# Altium project GeecPE.PrjPcb
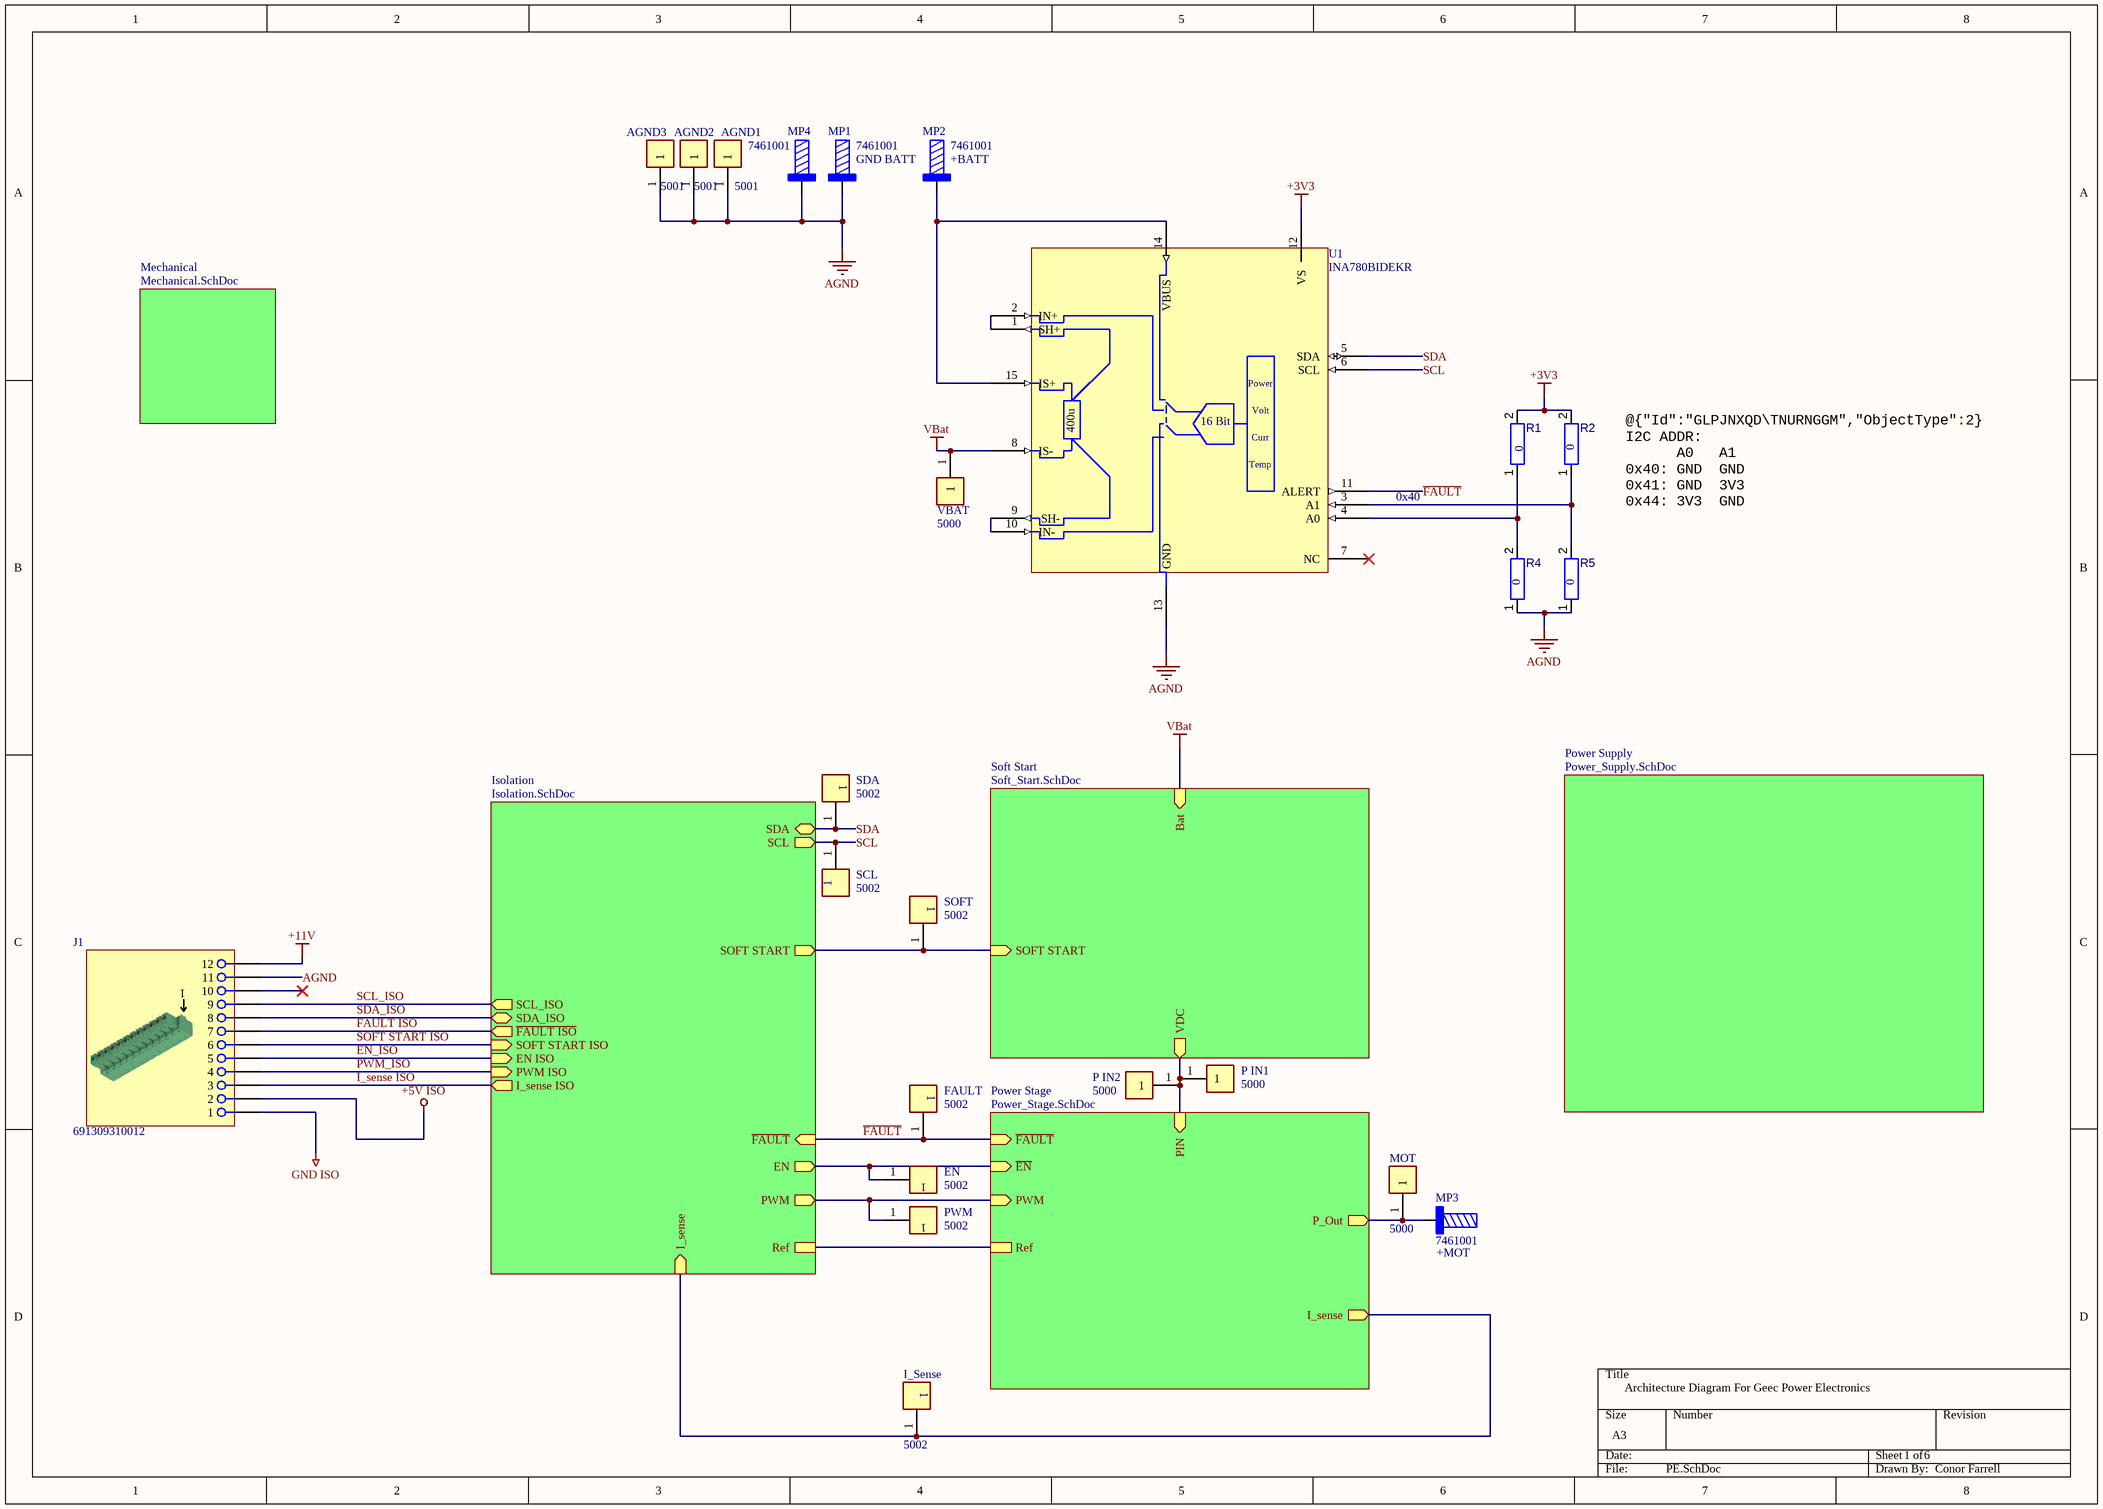
[diagram p0: PE.SchDoc]
6 sheets, 166 parts. Net scope: hierarchical (ports join the sheet entries above them; power ports are global).
Board file: PowerElec.PcbDoc
Sheets:
  PE.SchDoc
    Soft Start = Soft_Start.SchDoc
    Isolation = Isolation.SchDoc
    Power Supply = Power_Supply.SchDoc
    Power Stage = Power_Stage.SchDoc
    Mechanical = Mechanical.SchDoc

## Sheet PE.SchDoc: Architecture Diagram For Geec Power Electronics
size A3; Author: Conor Farrell; SheetNumber: 1; SheetTotal: 6

### Parts
AGND1  5001  [FP-5001-MFG]
AGND2  5001  [FP-5001-MFG]
AGND3  5001  [FP-5001-MFG]
EN  5002  [FP-5002-MFG]
FAULT  5002  [FP-5002-MFG]
I_Sense  5002  [FP-5002-MFG]
J1  691309310012  [691309310012]
MOT  5000  [FP-5000-MFG]
MP1  7461001  [7461001_chemical surface]
MP2  7461001  [7461001_chemical surface]
MP3  7461001  [7461001_chemical surface]
MP4  7461001  [7461001_chemical surface]
P_IN1  5000  [FP-5000-MFG]
P_IN2  5000  [FP-5000-MFG]
PWM  5002  [FP-5002-MFG]
R1  value 0  [RESC3216X60X45NL15T20]  (hidden comment: 1206W4F0000T5E)
R2  value 0  [RESC3216X60X45NL15T20]  (hidden comment: 1206W4F0000T5E)
R4  value 0  [RESC3216X60X45NL15T20]  (hidden comment: 1206W4F0000T5E)
R5  value 0  [RESC3216X60X45NL15T20]  (hidden comment: 1206W4F0000T5E)
SCL  5002  [FP-5002-MFG]
SDA  5002  [FP-5002-MFG]
SOFT  5002  [FP-5002-MFG]
U1  INA780BIDEKR  [VQFN15_DEK_TEX]
VBAT  5000  [FP-5000-MFG]

### Sub-sheets
Isolation = Isolation.SchDoc: Ref, I_sense (in), PWM (out), ~{FAULT ISO} (out), ~{FAULT} (in), SOFT START ISO (in), SOFT START (out), SDA_ISO (bidir), SDA (bidir), SCL_ISO (out), SCL (out), PWM ISO (in), I_sense ISO (out), EN ISO (in), EN (out)
Mechanical = Mechanical.SchDoc: no entries
Power Stage = Power_Stage.SchDoc: PIN (in), Ref, I_sense (out), P_Out (out), ~{EN} (in), ~{FAULT} (in), PWM (in)
Power Supply = Power_Supply.SchDoc: no entries
Soft Start = Soft_Start.SchDoc: Bat (in), VDC (out), SOFT START (in)

### Nets
+3V3: R1.2 R2.2 U1.12(VS)
+5V ISO: J1.2
+11V: J1.12
AGND: AGND1.1 AGND2.1 AGND3.1 J1.11 MP1.1 MP4.1 R4.1 R5.1 U1.13(GND)
GND ISO: J1.1
P_IN: P_IN1.1 P_IN2.1 ; sheet Soft Start/VDC, sheet Power Stage/PIN
VBat: U1.8(IS-) VBAT.1 ; sheet Soft Start/Bat
~{FAULT}: FAULT.1 U1.11(ALERT) ; sheet Isolation/~{FAULT}, sheet Power Stage/~{FAULT}
~{FAULT ISO}: J1.7 ; sheet Isolation/~{FAULT ISO}
EN_ISO: J1.5 ; sheet Isolation/EN ISO
I_sense ISO: J1.3 ; sheet Isolation/I_sense ISO
PWM: PWM.1 ; sheet Isolation/PWM, sheet Power Stage/PWM
PWM_ISO: J1.4 ; sheet Isolation/PWM ISO
SCL: SCL.1 U1.6(SCL) ; sheet Isolation/SCL
SCL_ISO: J1.9 ; sheet Isolation/SCL_ISO
SDA: SDA.1 U1.5(SDA) ; sheet Isolation/SDA
SDA_ISO: J1.8 ; sheet Isolation/SDA_ISO
Soft START: SOFT.1 ; sheet Soft Start/SOFT START, sheet Isolation/SOFT START
SOFT START ISO: J1.6 ; sheet Isolation/SOFT START ISO
NetEN_1: EN.1 ; sheet Isolation/EN, sheet Power Stage/~{EN}
NetI_Sense_1: I_Sense.1 ; sheet Isolation/I_sense, sheet Power Stage/I_sense
NetMOT_1: MOT.1 MP3.1 ; sheet Power Stage/P_Out
NetMP2_1: MP2.1 U1.14(VBUS) U1.15(IS+)
NetP5_2: sheet Isolation/Ref, sheet Power Stage/Ref
NetR1_1: R1.1 R4.2 U1.4(A0)
NetR2_1: R2.1 R5.2 U1.3(A1)
NetU1_1: U1.1(SH+) U1.2(IN+)
NetU1_9: U1.9(SH-) U1.10(IN-)

Not connected (* = marked no-connect by the designer): J1 10*; U1 7(NC)*

### Notes on the sheet
- (near MP1) GND BATT
- (near MP2) +BATT
- 0x40
- @{"Id":"GLPJNXQD\TNURNGGM","ObjectType":2} I2C ADDR:
  A0   A1
  0x40: GND  GND
  0x41: GND  3V3
  0x44: 3V3  GND
  0x45: 3V3  3V3
- (near MP3) +MOT
- (in symbol CMP-004-000000-8) Power; Volt; 400u; 16 Bit; Curr; Temp

### Library data of the parts
AGND1-AGND3 = CMP-00030-00001-2: Test Point, Mini, Thm, Pc, .300 L, .100 Od, Heat Resistant Nylon 46, Black; Hole Diameter: 1.6mm; Color: Black; Pins: 1; Mounting Technology: PCB, Through Hole
EN FAULT I_Sense PWM SCL SDA SOFT = CMP-00030-00002-2: Test Point, Mini, Thm, Pc, .300 L, .100 Od, Heat Resistant Nylon 46, White; Hole Diameter: 1.6mm; Color: White; Mounting Technology: PCB, Through Hole
J1 = CMP-002-00074-3: Terminal Block, 3.81MM Pitch, Horizontal With Coding Finger, Tht, 12 Pins; pin to pad: 1>1A+1B 2>2A+2B 3>3A+3B 4>4A+4B 5>5A+5B 6>6A+6B 7>7A+7B 8>8A+8B 9>9A+9B 10>10A+10B 11>11A+11B 12>12A+12B; Gender: Female; System: Connector; MPN: 691309310012
MOT P_IN1 P_IN2 VBAT = CMP-00030-00004-2: Cable Wrap, 1/2 Inch, Polyethylene, Natural, 50 Ft, Spirap Series; Hole Diameter: 1.6mm; Mounting Technology: PCB, Through Hole; Color: Red
MP1-MP4 = CMP-002-00075-3: Pcb Terminal, Brass, Press-Fit Rohs Compliant: Yes; Current Rating: 130A; Height: 12mm; Max Operating Temperature: 150°C; Min Operating Temperature: -55°C; Pins: 9; Material: Brass
R1 R2 R4 R5 = CMP-009-00183-1: Thick Film Resistors - SMD RMC 1206 1/4W 1% T/R-5000; Case/Package: 1206; JLCPN: C17888
U1 = CMP-004-000000-8: 85-V 16-bit I²C-output digital power monitor with 400-ÂµOhm EZShunt Technology 15-VQFN -40 to 125; Manufacturer_Name: Texas Instruments; Copyright: Copyright (C) 2025 Ultra Librarian. All rights reserved.; Datasheet: https://www.ti.com/lit/gpn/ina780b; Type: Linear; Pins: 15; RefDes: RefDes; Manufacturer_Part_Number: PINA780BIDEKR; Design Item ID: PINA780BIDEKR; Source: PINA780BIDEKR.SchLib; Case/Package: VQFN; JLCPN: C34740774; MPN: INA780BIDEKR

## Sheet Soft_Start.SchDoc: Soft Start For Geec Power Electronics
size A4; SheetNumber: 5; SheetTotal: 6
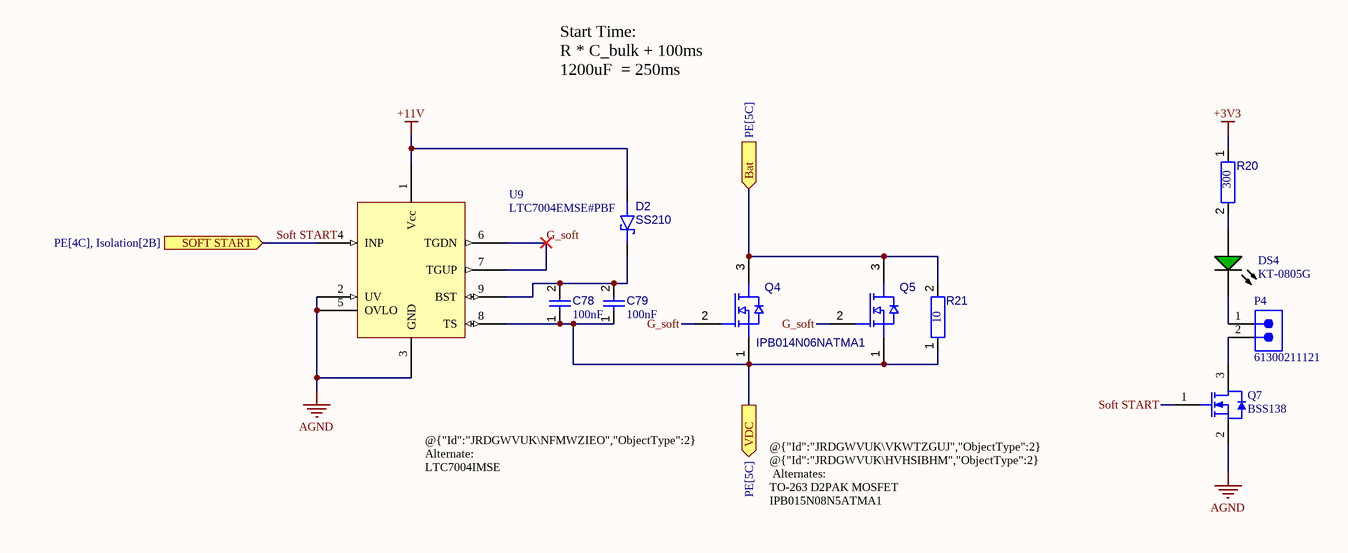
[diagram p1: Soft_Start.SchDoc]

### Parts
C78  value 100nF  [CAPC3216X06N]  (hidden comment: C1206C104K1RACTU)
C79  value 100nF  [CAPC3216X06N]  (hidden comment: C1206C104K1RACTU)
D2  SS210  [DIOM4226X24N]
DS4  KT-0805G  [WL-SMCW_0805_150080xx75000]
P4  61300211121  [61300211121]
Q4  IPB014N06NATMA1  [INF-PG-TO263-7-1_M]
Q5  IPB014N06NATMA1  [INF-PG-TO263-7-1_M]  (value not drawn)
Q7  BSS138  [FAIR-SOT23-3_V]
R20  value 300  [RESC3216X89X51NL25T25]  (hidden comment: 1206W4F3000T5E)
R21  value 10  [1623730-2-Footprint-1]  (hidden comment: 1623730-2)
U9  LTC7004EMSE#PBF  [TSSOP50P490X110_HS-11N]

### Ports
Bat (in, see PE[5C]), SOFT START (in, see PE[4C], Isolation[2B]), VDC (out, see PE[5C])

### Nets
+3V3: R20.1
+11V: D2.2(A) U9.1(Vcc)
AGND: Q7.2(S) U9.2(UV) U9.3(GND) U9.5(OVLO)
P_IN: C78.1 C79.1 Q4.1(S) Q5.1(S) R21.1 U9.8(TS) ; port VDC
VBat: Q4.3(D) Q5.3(D) R21.2 ; port Bat
G_soft: Q4.2(G) Q5.2(G) U9.6(TGDN) U9.7(TGUP)
Soft START: Q7.1(G) U9.4(INP) ; port SOFT START
NetC78_2: C78.2 C79.2 D2.1(K) U9.9(BST)
NetDS4_1: DS4.1(A) R20.2
NetDS4_2: DS4.2(K) P4.1
NetP4_2: P4.2 Q7.3(D)

### Notes on the sheet
- Start Time:
  R * C_bulk + 100ms
  1200uF  = 250ms
- @{"Id":"JRDGWVUK\NFMWZIEO","ObjectType":2} Alternate:
  LTC7004IMSE
- @{"Id":"JRDGWVUK\VKWTZGUJ","ObjectType":2} @{"Id":"JRDGWVUK\HVHSIBHM","ObjectType":2}
  Alternates:
  TO-263 D2PAK MOSFET
  IPB015N08N5ATMA1

### Library data of the parts
C78 C79 = CMP-001-00083-1: Ceramic Capacitor, Multilayer, Ceramic, 200V, 10% +Tol, 10% -Tol, X7R, 15% TC, 0.01uF, 1206; Voltage Rating: 100V; Case/Package: 1206; Pins: 2; Mounting Technology: Surface Mount; Min Operating Temperature: -55°C; Max Operating Temperature: 125°C; Tolerance: 10%
D2 = CMP-004-00033-2: Rectifier Diode, Schottky, 1 Phase, 1 Element, 2A, 100V V(RRM), Silicon, DO-214AA; Forward Voltage: 850mV; Pins: 2; Min Operating Temperature: -65°C; Max Operating Temperature: 150°C; JLCPN: C14996; Case/Package: SMB; Forward Current: 2A
DS4 = CMP-007-00037-1: -40℃~+85℃ 100mW 120° 2.6V~3.1V 430mcd 513nm~528nm 525nm 5mA Emerald Green 0805 LED Indication - Discrete ROHS; Colour: Green; Case/Package: 0805; JLCPN: C2297
P4 = CMP-002-00208-1: WR-PHD Pin Header, THT, Vertical, pitch 2.54mm, 1 Row, 2P; Manufacturer: Wurth Elektronik; Withstanding Voltage: 500V; Rated Current: 3A; Contact Resistance: 20mOhm; Working Voltage: 250V; Source: WR-PHD.SchLib; Mount: Through Hole; ComponentLink1Description: Website Link; Operating Temperature Max: 105°C; ComponentLink1URL: https://www.we-online.com/redexpert/article/61300211121?ad; Category: Board-to-Board Connectors; ComponentLink2URL: https://www.we-online.com/redexpert/spec/61300211121?ad; Number of Rows: 1; Orientation: Vertical; ComponentLink2Description: Datasheet Link; Operating Temperature Min: -40°C; Manufacturer Part Number: 61300211121; Match Code: WR-PHD; Design Item ID: 61300211121; Component Type: Standard; Pin Count: 2; Gender: Pin Header; Pitch: 2.54mm; Packaging: Bag; Pins: 2
Q4 Q5 = CMP-00000-5: Power MOSFET, N Channel, 60 V, 180 A, 0.0012 ohm, TO-263 (D2PAK), Surface Mount; pin to pad: 1>2+3+5+6+7 2>1 3>8; Drain to Source Breakdown Voltage: 60V; Drain to Source Resistance: 1.4mΩ; Continuous Drain Current (ID): 34A; Max Power Dissipation: 214W; Gate to Source Voltage (Vgs): 20V; Case/Package: TO-263-7; Drain to Source Voltage (Vdss): 60V
Q7 = CMP-013-00021-4: N-Channel Logic Level Enhancement Mode Field Effect Transistor, 220 mA, 50 V, -55 to 150 degC, 3-Pin SOT-23, RoHS, Tape and Reel; Manufacturer: Fairchild; Elements: 1; Nominal Vgs: 1.3V; Resistance: 0.7Ohm; Typical Rise Time: 9ns; Rds On Max: 3.5Ohm; Nominal Dual Supply Voltage: 50V; Input Capacitance: 27pF; Package Version: Rev. 12, 03/2016; Power: 360mW; Packaging: TapeandReel; Package Description: 3-Pin Small Outline Transistor, Body 2.92 x 1.325 mm, Pitch 0.95 mm; Datasheet URL: https://www.fairchildsemi.com/datasheets/BS/BSS138.pdf; Min Operating Temperature: -55°C; Pins: 3; RoHS Compliant: True; Package Reference: SOT23-3; Package Quantity: 1; Case/Package: TO-236-3; Mounting Technology: SM; Max Operating Temperature: 150°C; Datasheet Version: Rev. C, 10/2005
R20 = CMP-009-00190-1: 250mW Thick Film Resistors 200V ±100ppm/℃ ±1% 300Ω 1206 Chip Resistor - Surface Mount ROHS
R21 = CMP-009-00189-1: Fixed Resistor, Wire Wound, 4W, 10ohm, 6.3246V, 5% +/-Tol, 400ppm/Cel, Through Hole Mount, 3228; Voltage Rating: 6.3V; Pins: 2; Case/Package: Axial; Max Operating Temperature: 275°C; Tolerance: 5%; Mounting Technology: Axial, Through Hole; Min Operating Temperature: -55°C
U9 = CMP-00024-00007-2: RoHS Compliant PRODUCTION (Last Updated: 2weeks ago) MSOP IC Gate Driver; pin to pad: 3>3+11; Case/Package: MSOP; Pins: 10

## Sheet Isolation.SchDoc: Isolation For Geec Power Electronics
size A4; Author: Conor Farrell; SheetNumber: 3; SheetTotal: 6
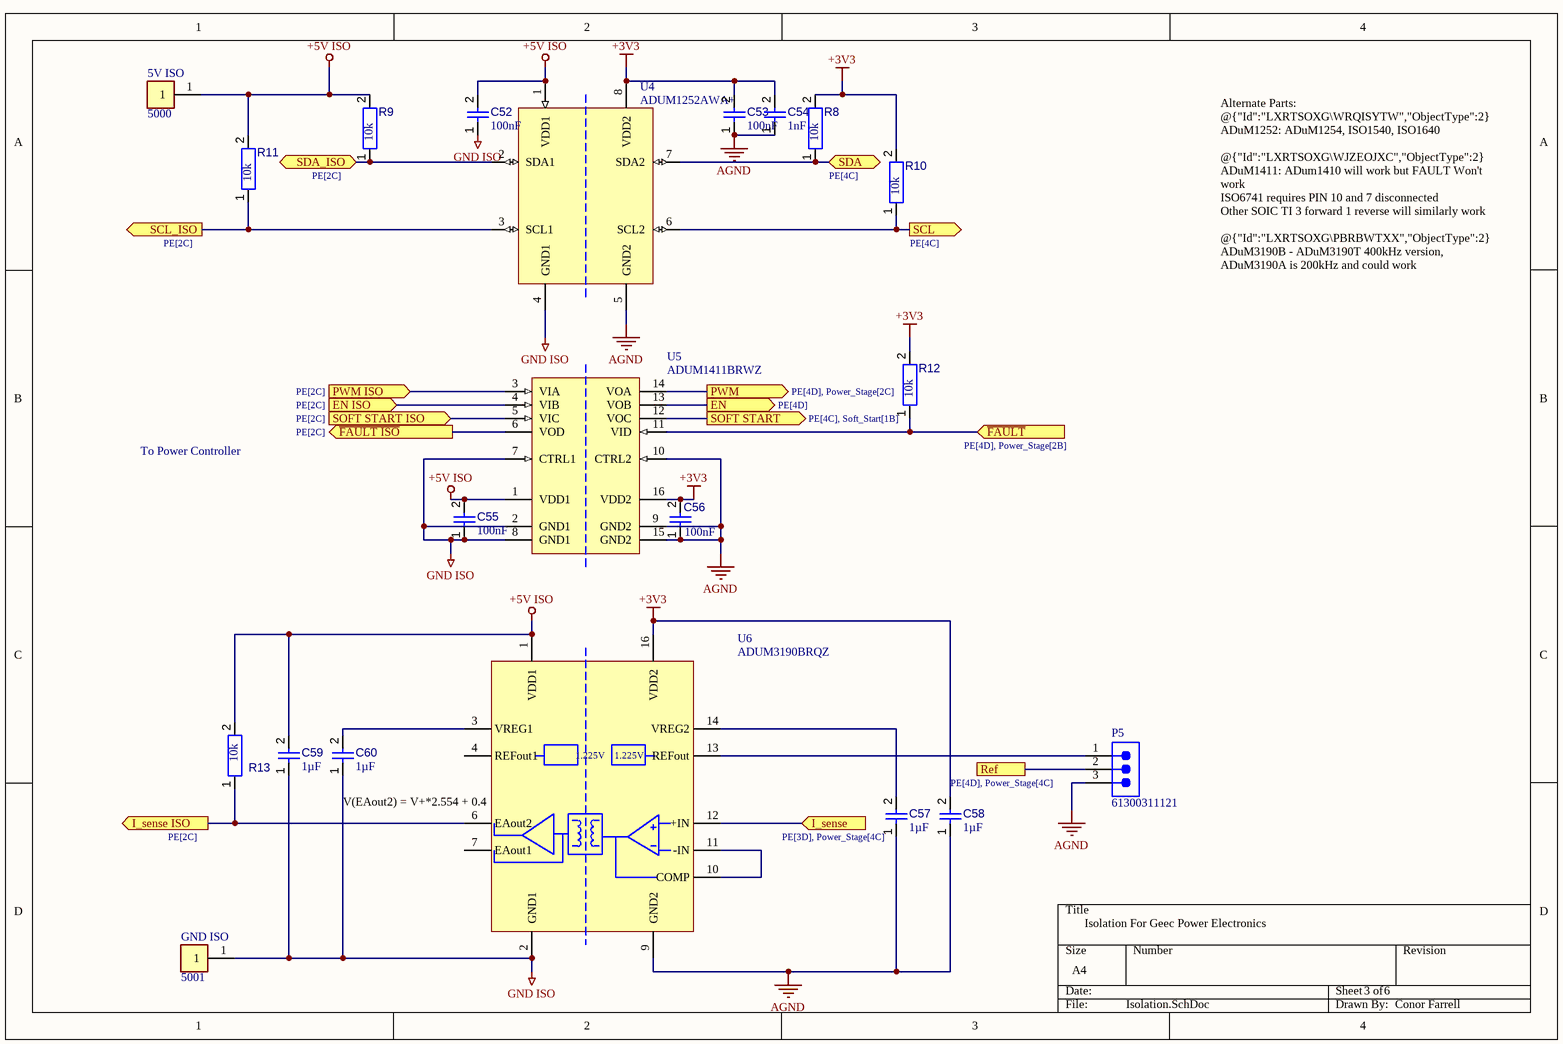
[diagram p2: Isolation.SchDoc]

### Parts
5V_ISO  5000  [FP-5000-MFG]
C52  value 100nF  [CAPC3216X06N]  (hidden comment: C1206C104K1RACTU)
C53  value 100nF  [CAPC3216X06N]  (hidden comment: C1206C104K1RACTU)
C54  value 1nF  [FP-CL31-IPC_A]  (hidden comment: CL31B102KGFNNNE)
C55  value 100nF  [CAPC3216X06N]  (hidden comment: C1206C104K1RACTU)
C56  value 100nF  [CAPC3216X06N]  (hidden comment: C1206C104K1RACTU)
C57  value 1µF  [CAPC3216X180X20ML20]  (hidden comment: CL31B105KBHNNNE)
C58  value 1µF  [CAPC3216X180X20ML20]  (hidden comment: CL31B105KBHNNNE)
C59  value 1µF  [CAPC3216X180X20ML20]  (hidden comment: CL31B105KBHNNNE)
C60  value 1µF  [CAPC3216X180X20ML20]  (hidden comment: CL31B105KBHNNNE)
GND_ISO  5001  [FP-5001-MFG]
P5  61300311121  [61300311121]
R8  value 10k  [RESC3216X60X45ML15T20]  (hidden comment: 1206W4F1002T5E)
R9  value 10k  [RESC3216X60X45ML15T20]  (hidden comment: 1206W4F1002T5E)
R10  value 10k  [RESC3216X60X45ML15T20]  (hidden comment: 1206W4F1002T5E)
R11  value 10k  [RESC3216X60X45ML15T20]  (hidden comment: 1206W4F1002T5E)
R12  value 10k  [RESC3216X60X45ML15T20]  (hidden comment: 1206W4F1002T5E)
R13  value 10k  [RESC3216X60X45ML15T20]  (hidden comment: 1206W4F1002T5E)
U4  ADUM1252AWA+  [SOIC127P1030X265-8N]
U5  ADUM1411BRWZ  [ADI-RW-16_M]
U6  ADUM3190BRQZ  [SOP64P600X175-16N]

### Ports
EN (out, see PE[4D]), EN ISO (in, see PE[2C]), I_sense (in, see PE[3D], Power_Stage[4C]), I_sense ISO (out, see PE[2C]), PWM (out, see PE[4D], Power_Stage[2C]), PWM ISO (in, see PE[2C]), Ref (see PE[4D], Power_Stage[4C]), SCL (out, see PE[4C]), SCL_ISO (out, see PE[2C]), SDA (bidir, see PE[4C]), SDA_ISO (bidir, see PE[2C]), SOFT START (out, see PE[4C], Soft_Start[1B]), SOFT START ISO (in, see PE[2C]), ~{FAULT ISO} (out, see PE[2C]), ~{FAULT} (in, see PE[4D], Power_Stage[2B])

### Nets
+3V3: C53.2 C54.2 C56.2 C58.2 R8.2 R10.2 R12.2 U4.8(VDD2) U5.16(VDD2) U6.16(VDD2)
+5V ISO: 5V_ISO.1 C52.2 C55.2 C59.2 R9.2 R11.2 R13.2 U4.1(VDD1) U5.1(VDD1) U6.1(VDD1)
AGND: C53.1 C54.1 C56.1 C57.1 C58.1 P5.3 U4.5(GND2) U5.9(GND2) U5.10(CTRL2) U5.15(GND2) U6.9(GND2)
GND ISO: C52.1 C55.1 C59.1 C60.1 GND_ISO.1 U4.4(GND1) U5.2(GND1) U5.7(CTRL1) U5.8(GND1) U6.2(GND1)
~{FAULT}: R12.1 U5.11(VID) ; port ~{FAULT}
~{FAULT ISO}: U5.6(VOD) ; port ~{FAULT ISO}
EN_ISO: U5.4(VIB) ; port EN ISO
I_sense ISO: R13.1 U6.6(EAout2) ; port I_sense ISO
PWM: U5.14(VOA) ; port PWM
PWM_ISO: U5.3(VIA) ; port PWM ISO
SCL: R10.1 U4.6(SCL2) ; port SCL
SCL_ISO: R11.1 U4.3(SCL1) ; port SCL_ISO
SDA: R8.1 U4.7(SDA2) ; port SDA
SDA_ISO: R9.1 U4.2(SDA1) ; port SDA_ISO
Soft START: U5.12(VOC) ; port SOFT START
SOFT START ISO: U5.5(VIC) ; port SOFT START ISO
NetC57_2: C57.2 U6.14(VREG2)
NetC60_2: C60.2 U6.3(VREG1)
NetEN_1: U5.13(VOB) ; port EN
NetI_Sense_1: U6.12(+IN) ; port I_sense
NetP5_1: P5.1 U6.13(REFout)
NetP5_2: P5.2 ; port Ref
NetU6_10: U6.10(COMP) U6.11(-IN)

Not connected (* = marked no-connect by the designer): U6 4(REFout1) 7(EAout1)

### Notes on the sheet
- Alternate Parts:
  @{"Id":"LXRTSOXG\WRQISYTW","ObjectType":2} ADuM1252: ADuM1254, ISO1540, ISO1640
  @{"Id":"LXRTSOXG\WJZEOJXC","ObjectType":2} ADuM1411: ADum1410 will work but FAULT Won't work
  ISO6741 requires PIN 10 and 7 disconnected
  Other SOIC TI 3 forward 1 reverse will similarly work
  @{"Id":"LXRTSOXG\PBRBWTXX","ObjectType":2} ADuM3190B - ADuM3190T 400kHz version, ADuM3190A is 200kHz and could work
- To Power Controller
- (near U6) V(EAout2) = V+*2.554 + 0.4
- (in symbol CMP-014-00002-3) 1.225V

### Library data of the parts
5V_ISO = CMP-00030-00004-2: as MOT on sheet PE; Mounting Technology: PCB, Through Hole; Color: Red
C52 C53 C55 C56 = CMP-001-00083-1: as C78 on sheet Soft_Start; Case/Package: 1206; Pins: 2; Mounting Technology: Surface Mount; Min Operating Temperature: -55°C; Max Operating Temperature: 125°C; Tolerance: 10%
C54 = CMP-001-00090-1: Ceramic Capacitor, Multilayer, Ceramic, 500V, 10% +Tol, 10% -Tol, X7R, +-15% TC, 1nF, Surface Mount, 1206 inch; Min Operating Temperature: -55°C; Mounting Technology: Surface Mount; Tolerance: 10%; Max Operating Temperature: 125°C; Case/Package: 1206; Voltage Rating: 500V
C57-C60 = CMP-001-00086-1: Ceramic Capacitor, Multilayer, Ceramic, 50V, 10% +Tol, 10% -Tol, X7R, +-15% TC, 1uF, Surface Mount, 1206 inch; Mounting Technology: Surface Mount; JLCPN: C1848; Max Operating Temperature: 125°C; Min Operating Temperature: -55°C; Case/Package: 1206; Tolerance: 10%; Voltage Rating: 50V
GND_ISO = CMP-00030-00001-2: as AGND1 on sheet PE; Color: Black; Pins: 1; Mounting Technology: PCB, Through Hole
P5 = CMP-002-00212-1: WR-PHD Pin Header, THT, Vertical, pitch 2.54mm, 1 Row, 3P; Manufacturer: Wurth Elektronik; Contact Resistance: 20mOhm; Withstanding Voltage: 500V; Rated Current: 3A; Working Voltage: 250V; Pin Count: 3; Gender: Pin Header; Pins: 3; Number of Rows: 1; Packaging: Bag; Pitch: 2.54mm; Match Code: WR-PHD; ComponentLink1URL: https://www.we-online.com/redexpert/article/61300311121?ad; ComponentLink2URL: https://www.we-online.com/redexpert/spec/61300311121?ad; Orientation: Vertical; Operating Temperature Min: -40°C; Mount: Through Hole; Operating Temperature Max: 105°C; Source: WR-PHD.SchLib; Manufacturer Part Number: 61300311121; Design Item ID: 61300311121; Category: Board-to-Board Connectors; ComponentLink1Description: Website Link; Component Type: Standard; ComponentLink2Description: Datasheet Link
R8-R13 = CMP-009-00184-2: Res Thick Film 1206 10K Ohm 1% 0.25W(1/4W) ±100ppm/C Pad SMD T/R; JLCPN: C17902; Case/Package: 1206
U4 = CMP-016-00010-2: Ultra-Low Power, Bidirectional I2C Isolator with Extended VDD, Idle-Bus Hot-Swap and Low VOL; JLCPN: C44197888; MPN: ADUM1252AWA+
U5 = CMP-015-00009-2: Digital Isolator CMOS 4-CH 10Mbps 16-Pin SOIC W Tube / DGTL ISO 3.75KV GEN PURP 16SOIC; Min Supply Voltage: 2.7V; Max Supply Voltage: 5.5V; Pins: 16; Max Operating Temperature: 105°C; Case/Package: SOIC; Min Operating Temperature: -40°C; JLCPN: C660417
U6 = CMP-014-00002-3: High Stability Isolated Error Amplifier; pin to pad: 2>2+8 9>9+15; Max Supply Voltage: 20V; Min Supply Voltage: 3V; Max Operating Temperature: 85°C; Min Operating Temperature: -40°C; MPN: ADUM3190BRQZ; Case/Package: QSOP; Pins: 16; Mounting Technology: Surface Mount

## Sheet Power_Supply.SchDoc
size A4; Author: Conor Farrell; SheetNumber: 4; SheetTotal: 6
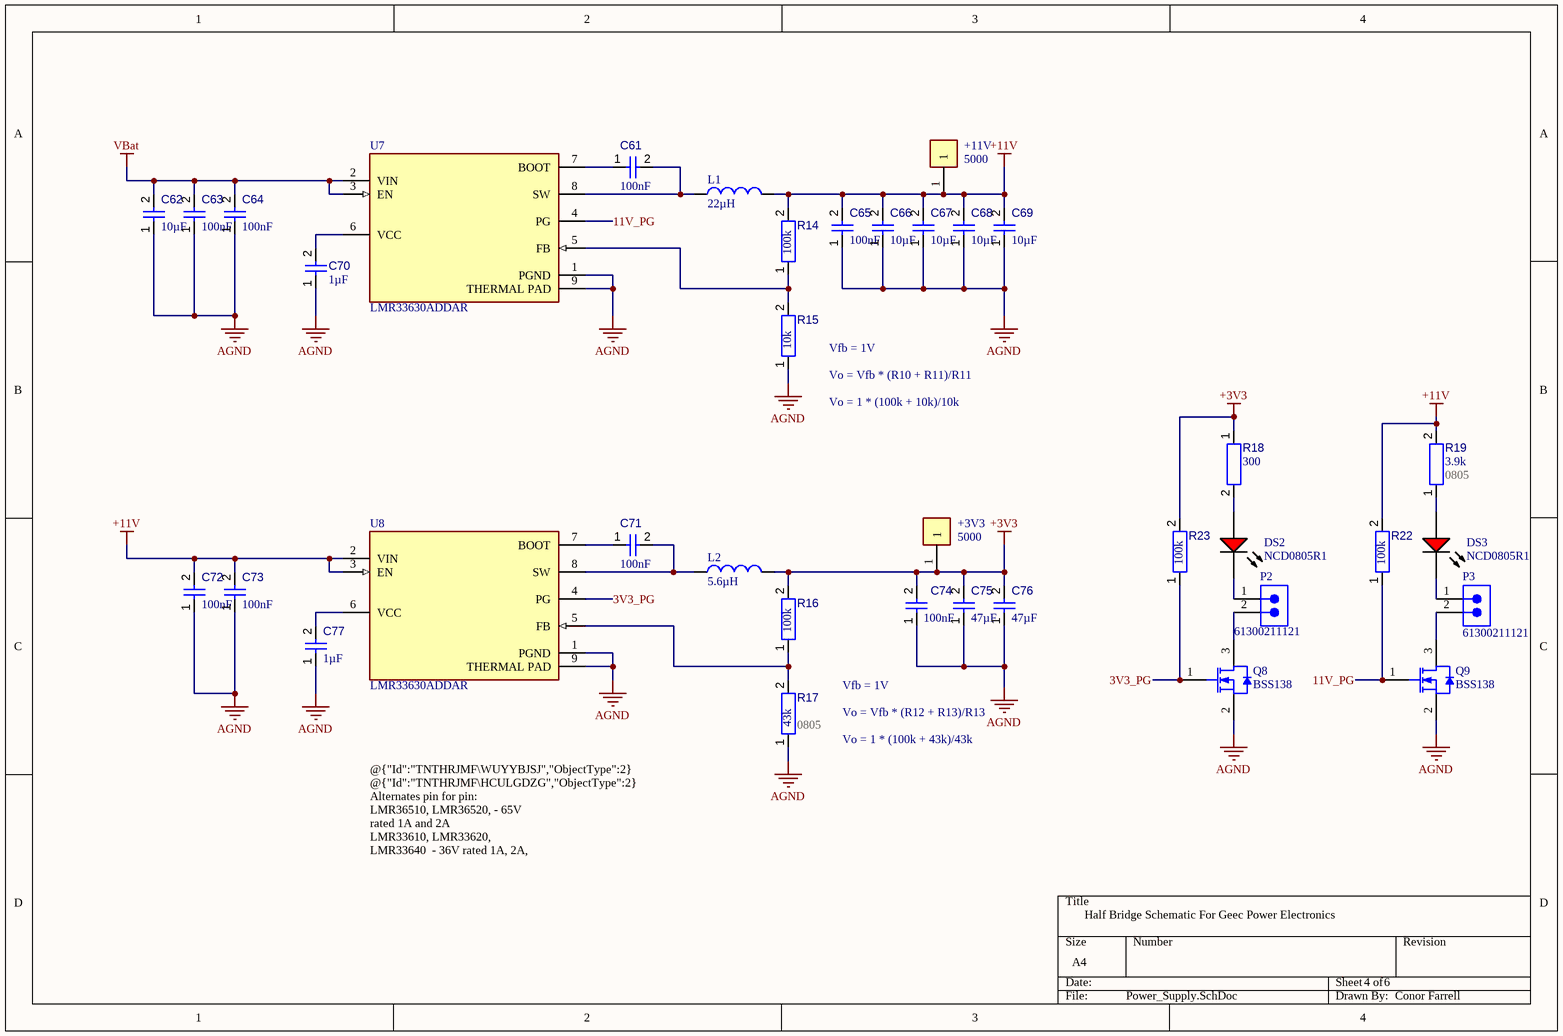
[diagram p3: Power_Supply.SchDoc]

### Parts
+3V3  5000  [FP-5000-MFG]
+11V  5000  [FP-5000-MFG]
C61  value 100nF  [CAPC3216X190X55ML30T25]  (hidden comment: CL31B104KBCNNNC)
C62  value 10µF  [FP-GCM32E-0_3-IPC_C]  (hidden comment: GCM32EC71H106KA03L)
C63  value 100nF  [CAPC3216X190X55ML30T25]  (hidden comment: CL31B104KBCNNNC)
C64  value 100nF  [CAPC3216X190X55ML30T25]  (hidden comment: CL31B104KBCNNNC)
C65  value 100nF  [CAPC3216X190X55ML30T25]  (hidden comment: CL31B104KBCNNNC)
C66  value 10µF  [FP-GCM32E-0_3-IPC_C]  (hidden comment: GCM32EC71H106KA03L)
C67  value 10µF  [FP-GCM32E-0_3-IPC_C]  (hidden comment: GCM32EC71H106KA03L)
C68  value 10µF  [FP-GCM32E-0_3-IPC_C]  (hidden comment: GCM32EC71H106KA03L)
C69  value 10µF  [FP-GCM32E-0_3-IPC_C]  (hidden comment: GCM32EC71H106KA03L)
C70  value 1µF  [CAPC3216X180X20ML20]  (hidden comment: CL31B105KBHNNNE)
C71  value 100nF  [CAPC3216X190X55ML30T25]  (hidden comment: CL31B104KBCNNNC)
C72  value 100nF  [CAPC3216X190X55ML30T25]  (hidden comment: CL31B104KBCNNNC)
C73  value 100nF  [CAPC3216X190X55ML30T25]  (hidden comment: CL31B104KBCNNNC)
C74  value 100nF  [CAPC3216X190X55ML30T25]  (hidden comment: CL31B104KBCNNNC)
C75  value 47µF  [CAPC3216X190X55LL30T25]  (hidden comment: CL31A476MPHNNNE)
C76  value 47µF  [CAPC3216X190X55LL30T25]  (hidden comment: CL31A476MPHNNNE)
C77  value 1µF  [CAPC3216X180X20ML20]  (hidden comment: CL31B105KBHNNNE)
DS2  NCD0805R1  [Copy of WL-SMCW_0805_150080xx75000]
DS3  NCD0805R1  [Copy of WL-SMCW_0805_150080xx75000]
L1  value 22µH  [INDP127127X85N]  (hidden comment: SRR1208-220ML)
L2  value 5.6µH  [INDP125125X60N]  (hidden comment: SRR1260A-5R6Y)
P2  61300211121  [61300211121]
P3  61300211121  [61300211121]
Q8  BSS138  [FAIR-SOT23-3_V]
Q9  BSS138  [FAIR-SOT23-3_V]
R14  value 100k  [RESC3216X60X45NL15T20]  (hidden comment: 1206W4F1003T5E)
R15  value 10k  [RESC3216X60X45ML15T20]  (hidden comment: 1206W4F1002T5E)
R16  value 100k  [RESC3216X60X45NL15T20]  (hidden comment: 1206W4F1003T5E)
R17  value 43k  Case/Package: 0805  [RESC0805(2012)_L]  (hidden comment: 0805W8F4302T5E)
R18  value 300  [RESC3216X89X51NL25T25]  (hidden comment: 1206W4F3000T5E)
R19  value 3.9k  Case/Package: 0805  [RESC2013X60X35ML10T20]  (hidden comment: 0805W8F3901T5E)
R22  value 100k  [RESC3216X60X45NL15T20]  (hidden comment: 1206W4F1003T5E)
R23  value 100k  [RESC3216X60X45NL15T20]  (hidden comment: 1206W4F1003T5E)
U7  LMR33630ADDAR  [SOIC127P600X170_HS-9N]
U8  LMR33630ADDAR  [SOIC127P600X170_HS-9N]

### Nets
+3V3: +3V3.1 C74.2 C75.2 C76.2 L2.2 R16.2 R18.1 R23.2
+11V: +11V.1 C65.2 C66.2 C67.2 C68.2 C69.2 C72.2 C73.2 L1.2 R14.2 R19.2 R22.2 U8.2(VIN) U8.3(EN)
AGND: C62.1 C63.1 C64.1 C65.1 C66.1 C67.1 C68.1 C69.1 C70.1 C72.1 C73.1 C74.1 C75.1 C76.1 C77.1 Q8.2(S) Q9.2(S) R15.1 R17.1 U7.1(PGND) U7.9(THERMAL_PAD) U8.1(PGND) U8.9(THERMAL_PAD)
VBat: C62.2 C63.2 C64.2 U7.2(VIN) U7.3(EN)
3V3_PG: Q8.1(G) R23.1 U8.4(PG)
11V_PG: Q9.1(G) R22.1 U7.4(PG)
NetC61_1: C61.1 U7.7(BOOT)
NetC61_2: C61.2 L1.1 U7.8(SW)
NetC70_2: C70.2 U7.6(VCC)
NetC71_1: C71.1 U8.7(BOOT)
NetC71_2: C71.2 L2.1 U8.8(SW)
NetC77_2: C77.2 U8.6(VCC)
NetDS2_1: DS2.1(A) R18.2
NetDS2_2: DS2.2(K) P2.1
NetDS3_1: DS3.1(A) R19.1
NetDS3_2: DS3.2(K) P3.1
NetP2_2: P2.2 Q8.3(D)
NetP3_2: P3.2 Q9.3(D)
NetR14_1: R14.1 R15.2 U7.5(FB)
NetR16_1: R16.1 R17.2 U8.5(FB)

### Notes on the sheet
- (near R15) Vfb = 1V
- (near R15) Vo = Vfb * (R10 + R11)/R11
- Vo = 1 * (100k + 10k)/10k
- Vfb = 1V
- Vo = Vfb * (R12 + R13)/R13
- Vo = 1 * (100k + 43k)/43k
- @{"Id":"TNTHRJMF\WUYYBJSJ","ObjectType":2} @{"Id":"TNTHRJMF\HCULGDZG","ObjectType":2}
  Alternates pin for pin:
  LMR36510, LMR36520, - 65V rated 1A and 2A
  LMR33610, LMR33620, LMR33640  - 36V rated 1A, 2A, 4A
- Half Bridge Schematic For Geec Power Electronics

### Library data of the parts
+3V3 +11V = CMP-00030-00004-2: as MOT on sheet PE; Mounting Technology: PCB, Through Hole; Color: Red
C61 C63-C65 C71-C74 = CMP-001-00089-1: 50V 100nF X7R ±10% 1206 Multilayer Ceramic Capacitors MLCC - SMD/SMT ROHS; Min Operating Temperature: -55°C; Mounting Technology: Surface Mount; Case/Package: 1206; Max Operating Temperature: 125°C; JLCPN: C24497; Voltage Rating: 50V; Tolerance: 10%
C62 C66-C69 = CMP-001-00085-1: 50V 10uF X7S ±10% 1210 Multilayer Ceramic Capacitors MLCC - SMD/SMT ROHS; Tolerance: 10%; Max Operating Temperature: 125°C; Case Code (Metric): 3225; Mounting Technology: Surface Mount; Case/Package: 1210; Min Operating Temperature: -55°C; Voltage Rating: 50V; Dielectric: X7S
C70 C77 = CMP-001-00086-1: as C57 on sheet Isolation; Mounting Technology: Surface Mount; JLCPN: C1848; Max Operating Temperature: 125°C; Min Operating Temperature: -55°C; Case/Package: 1206; Tolerance: 10%; Voltage Rating: 50V
C75 C76 = CMP-001-00087-1: Ceramic Capacitor, Multilayer, Ceramic, 10V, 20% +Tol, 20% -Tol, X5R, +-15% TC, 47uF, Surface Mount, 1206 inch; Voltage Rating: 10V; JLCPN: C96123; Mounting Technology: Surface Mount; Case/Package: 1206; Max Operating Temperature: 85°C; Tolerance: 20%; Min Operating Temperature: -55°C
DS2 DS3 = CMP-002-00586-1: 25mA Colorless Transparent Lens 67mcd~195mcd -30℃~+85℃ 615nm~630nm Independent Diode Red 130° 65mW 1.6V~2.6V 0805 LED...; pin to pad: 1>2 2>1; Case/Package: 0805; JLCPN: C84256
L1 = CMP-006-00022-1: Inductor Power Shielded Wirewound 22uH 20% 1KHz 23Q-Factor Ferrite 3.5A 0.043Ohm DCR T/R; Self Resonant Frequency: 7MHz; Tolerance: 20%; Max Operating Temperature: 125°C; Max Current Rating: 3.5A; Mounting Technology: Surface Mount; JLCPN: C2041332; Min Operating Temperature: -40°C; Case/Package: 5050; Current Rating: 3.5A; Pins: 2
L2 = CMP-006-00023-1: Ind Power Shielded Wirewound 5.6uH 30% 100KHz 19Q-Factor Ferrite 6.7A T/R; DC Resistance (DCR): 16.2mΩ; Self Resonant Frequency: 33MHz; Tolerance: 30%; JLCPN: C2042812; Max Operating Temperature: 125°C; Current Rating: 6.7A; Case/Package: Nonstandard; Max Current Rating: 6.7A; Mounting Technology: Surface Mount; Min Operating Temperature: -40°C
P2 P3 = CMP-002-00208-1: as P4 on sheet Soft_Start; Source: WR-PHD.SchLib; Mount: Through Hole; ComponentLink1Description: Website Link; Operating Temperature Max: 105°C; ComponentLink1URL: https://www.we-online.com/redexpert/article/61300211121?ad; Category: Board-to-Board Connectors; ComponentLink2URL: https://www.we-online.com/redexpert/spec/61300211121?ad; Number of Rows: 1; Orientation: Vertical; ComponentLink2Description: Datasheet Link; Operating Temperature Min: -40°C; Manufacturer Part Number: 61300211121; Match Code: WR-PHD; Design Item ID: 61300211121; Component Type: Standard; Pin Count: 2; Gender: Pin Header; Pitch: 2.54mm; Packaging: Bag; Pins: 2
Q8 Q9 = CMP-013-00021-4: as Q7 on sheet Soft_Start; Packaging: TapeandReel; Package Description: 3-Pin Small Outline Transistor, Body 2.92 x 1.325 mm, Pitch 0.95 mm; Datasheet URL: https://www.fairchildsemi.com/datasheets/BS/BSS138.pdf; Min Operating Temperature: -55°C; Pins: 3; RoHS Compliant: True; Package Reference: SOT23-3; Package Quantity: 1; Case/Package: TO-236-3; Mounting Technology: SM; Max Operating Temperature: 150°C; Datasheet Version: Rev. C, 10/2005
R14 R16 R22 R23 = CMP-009-00185-1: Fixed Resistor, Metal Glaze/thick Film, 0.25W, 100000ohm, 200V, 1% +/-Tol, 100ppm/Cel, Surface Mount, 1206; Mounting Technology: Surface Mount; Tolerance: 1%; Min Operating Temperature: -55°C; Max Operating Temperature: 155°C
R15 = CMP-009-00184-2: as R8 on sheet Isolation; JLCPN: C17902; Case/Package: 1206
R17 = CMP-009-00188-1: 125mW Thick Film Resistors 150V ±100ppm/℃ ±1% 43kΩ 0805 Chip Resistor - Surface Mount ROHS; Tolerance: 1%; Power: 125mW; JLCPN: C17695
R18 = CMP-009-00190-1: as R20 on sheet Soft_Start
R19 = CMP-009-00193-2: Res Thick Film 0805 3.9K Ohm 1% 0.125W(1/8W) ±100ppm/C Pad SMD T/R; Power: 125mW; JLCPN: C17614
U7 U8 = CMP-019-00051-2: SIMPLE SWITCHER® 3.8V to 36V, 3A Synchronous Buck Converter With Ultra-Low EMI 8-SO PowerPAD -40 to 125; Nominal Supply Current: 24µA; Pins: 8; Max Supply Voltage: 36V; Max Operating Temperature: 125°C; Min Operating Temperature: -40°C; Min Supply Voltage: 3.8V; Output Current: 3A; Topology: Buck

## Sheet Power_Stage.SchDoc: Half Bridge Schematic For Geec Power Electronics
size A4; Author: Conor Farrell; SheetNumber: 2; SheetTotal: 6
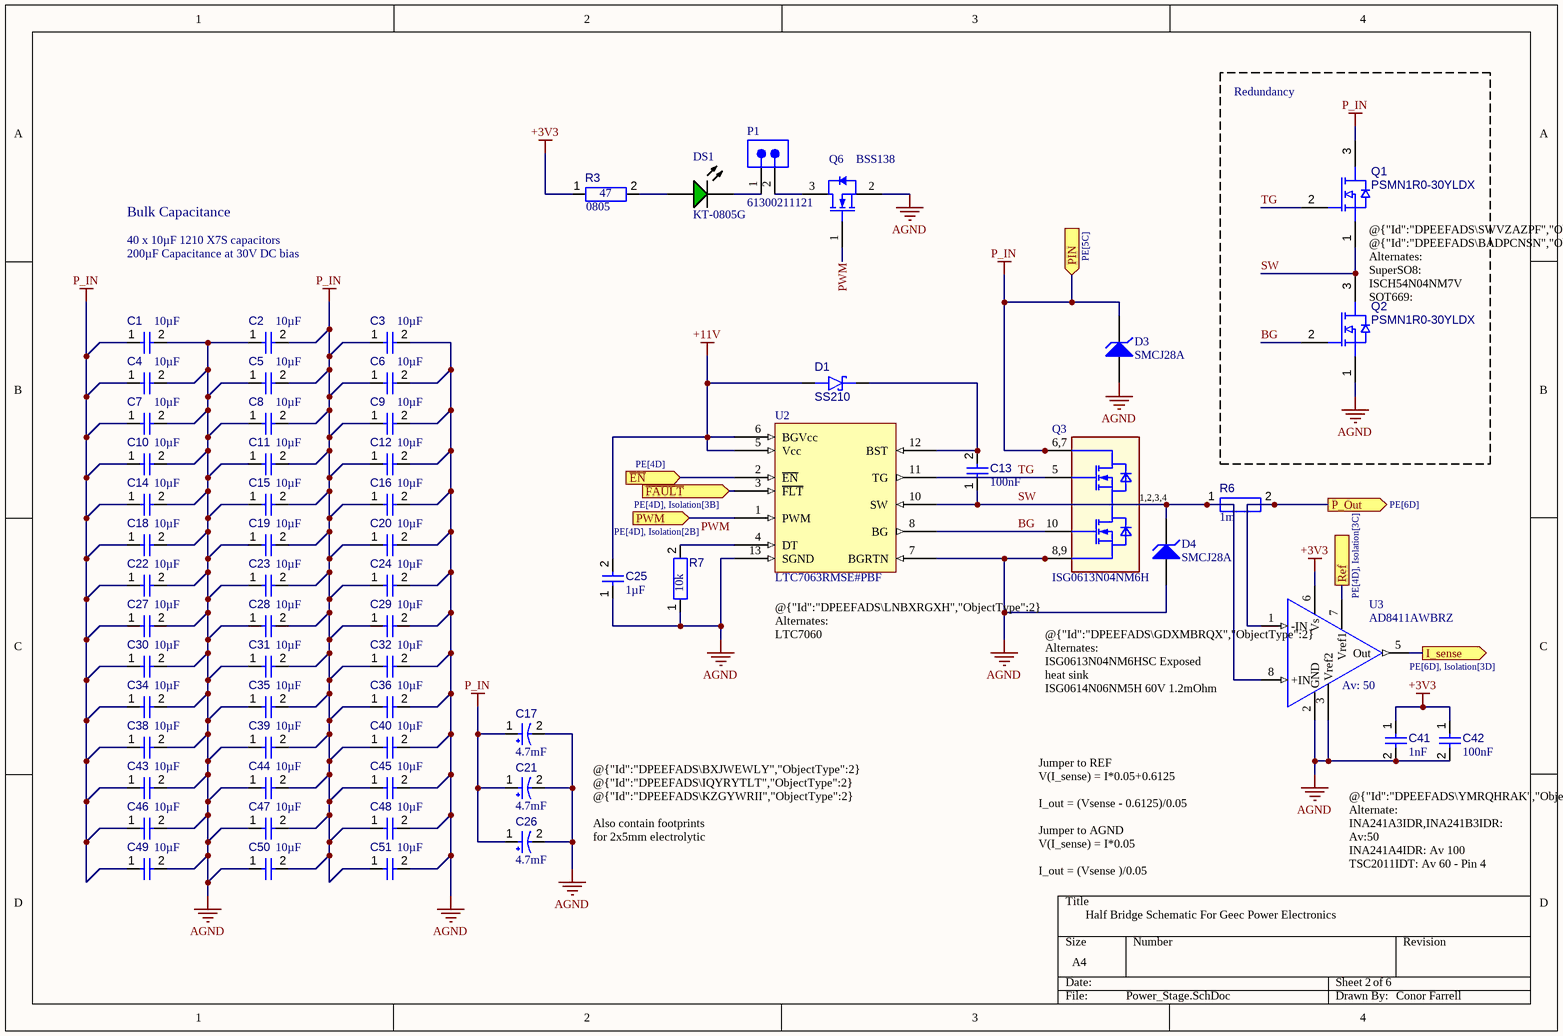
[diagram p4: Power_Stage.SchDoc]

### Parts
C1  value 10µF  [FP-GCM32E-0_3-IPC_C]  (hidden comment: GCM32EC71H106KA03L)
C2  value 10µF  [FP-GCM32E-0_3-IPC_C]  (hidden comment: GCM32EC71H106KA03L)
C3  value 10µF  [FP-GCM32E-0_3-IPC_C]  (hidden comment: GCM32EC71H106KA03L)
C4  value 10µF  [FP-GCM32E-0_3-IPC_C]  (hidden comment: GCM32EC71H106KA03L)
C5  value 10µF  [FP-GCM32E-0_3-IPC_C]  (hidden comment: GCM32EC71H106KA03L)
C6  value 10µF  [FP-GCM32E-0_3-IPC_C]  (hidden comment: GCM32EC71H106KA03L)
C7  value 10µF  [FP-GCM32E-0_3-IPC_C]  (hidden comment: GCM32EC71H106KA03L)
C8  value 10µF  [FP-GCM32E-0_3-IPC_C]  (hidden comment: GCM32EC71H106KA03L)
C9  value 10µF  [FP-GCM32E-0_3-IPC_C]  (hidden comment: GCM32EC71H106KA03L)
C10  value 10µF  [FP-GCM32E-0_3-IPC_C]  (hidden comment: GCM32EC71H106KA03L)
C11  value 10µF  [FP-GCM32E-0_3-IPC_C]  (hidden comment: GCM32EC71H106KA03L)
C12  value 10µF  [FP-GCM32E-0_3-IPC_C]  (hidden comment: GCM32EC71H106KA03L)
C13  value 100nF  [CAPC3216X06N]  (hidden comment: C1206C104K1RACTU)
C14  value 10µF  [FP-GCM32E-0_3-IPC_C]  (hidden comment: GCM32EC71H106KA03L)
C15  value 10µF  [FP-GCM32E-0_3-IPC_C]  (hidden comment: GCM32EC71H106KA03L)
C16  value 10µF  [FP-GCM32E-0_3-IPC_C]  (hidden comment: GCM32EC71H106KA03L)
C17  value 4.7mF  [UVR1J472MRD-Footprint-1]  (hidden comment: UVR1J472MRD)
C18  value 10µF  [FP-GCM32E-0_3-IPC_C]  (hidden comment: GCM32EC71H106KA03L)
C19  value 10µF  [FP-GCM32E-0_3-IPC_C]  (hidden comment: GCM32EC71H106KA03L)
C20  value 10µF  [FP-GCM32E-0_3-IPC_C]  (hidden comment: GCM32EC71H106KA03L)
C21  value 4.7mF  [UVR1J472MRD-Footprint-1]  (hidden comment: UVR1J472MRD)
C22  value 10µF  [FP-GCM32E-0_3-IPC_C]  (hidden comment: GCM32EC71H106KA03L)
C23  value 10µF  [FP-GCM32E-0_3-IPC_C]  (hidden comment: GCM32EC71H106KA03L)
C24  value 10µF  [FP-GCM32E-0_3-IPC_C]  (hidden comment: GCM32EC71H106KA03L)
C25  value 1µF  [CAPC3216X180X20ML20]  (hidden comment: CL31B105KBHNNNE)
C26  value 4.7mF  [UVR1J472MRD-Footprint-1]  (hidden comment: UVR1J472MRD)
C27  value 10µF  [FP-GCM32E-0_3-IPC_C]  (hidden comment: GCM32EC71H106KA03L)
C28  value 10µF  [FP-GCM32E-0_3-IPC_C]  (hidden comment: GCM32EC71H106KA03L)
C29  value 10µF  [FP-GCM32E-0_3-IPC_C]  (hidden comment: GCM32EC71H106KA03L)
C30  value 10µF  [FP-GCM32E-0_3-IPC_C]  (hidden comment: GCM32EC71H106KA03L)
C31  value 10µF  [FP-GCM32E-0_3-IPC_C]  (hidden comment: GCM32EC71H106KA03L)
C32  value 10µF  [FP-GCM32E-0_3-IPC_C]  (hidden comment: GCM32EC71H106KA03L)
C34  value 10µF  [FP-GCM32E-0_3-IPC_C]  (hidden comment: GCM32EC71H106KA03L)
C35  value 10µF  [FP-GCM32E-0_3-IPC_C]  (hidden comment: GCM32EC71H106KA03L)
C36  value 10µF  [FP-GCM32E-0_3-IPC_C]  (hidden comment: GCM32EC71H106KA03L)
C38  value 10µF  [FP-GCM32E-0_3-IPC_C]  (hidden comment: GCM32EC71H106KA03L)
C39  value 10µF  [FP-GCM32E-0_3-IPC_C]  (hidden comment: GCM32EC71H106KA03L)
C40  value 10µF  [FP-GCM32E-0_3-IPC_C]  (hidden comment: GCM32EC71H106KA03L)
C41  value 1nF  [FP-CL31-IPC_A]  (hidden comment: CL31B102KGFNNNE)
C42  value 100nF  [CAPC3216X06N]  (hidden comment: C1206C104K1RACTU)
C43  value 10µF  [FP-GCM32E-0_3-IPC_C]  (hidden comment: GCM32EC71H106KA03L)
C44  value 10µF  [FP-GCM32E-0_3-IPC_C]  (hidden comment: GCM32EC71H106KA03L)
C45  value 10µF  [FP-GCM32E-0_3-IPC_C]  (hidden comment: GCM32EC71H106KA03L)
C46  value 10µF  [FP-GCM32E-0_3-IPC_C]  (hidden comment: GCM32EC71H106KA03L)
C47  value 10µF  [FP-GCM32E-0_3-IPC_C]  (hidden comment: GCM32EC71H106KA03L)
C48  value 10µF  [FP-GCM32E-0_3-IPC_C]  (hidden comment: GCM32EC71H106KA03L)
C49  value 10µF  [FP-GCM32E-0_3-IPC_C]  (hidden comment: GCM32EC71H106KA03L)
C50  value 10µF  [FP-GCM32E-0_3-IPC_C]  (hidden comment: GCM32EC71H106KA03L)
C51  value 10µF  [FP-GCM32E-0_3-IPC_C]  (hidden comment: GCM32EC71H106KA03L)
D1  SS210  [DIOM4226X24N]
D3  SMCJ28A  [FAIR-DO-214AB-2_V]
D4  SMCJ28A  [FAIR-DO-214AB-2_V]
DS1  KT-0805G  [WL-SMCW_0805_150080xx75000]
P1  61300211121  [61300211121]
Q1  PSMN1R0-30YLDX  [NXP-SOT669_L]
Q2  PSMN1R0-30YLDX  [NXP-SOT669_L]
Q3  ISG0613N04NM6H  [IFX-PG-VITFN-10-1-V]
Q6  BSS138  [FAIR-SOT23-3_V]
R3  value 47  Case/Package: 0805  [RESC2013X70X40ML20T20]  (hidden comment: 0805W8F470JT5E)
R6  value 1m  [RESC6331X09N]  (hidden comment: CHSA2512R0010F)
R7  value 10k  [RESC3216X60X45ML15T20]  (hidden comment: 1206W4F1002T5E)
U2  LTC7063RMSE#PBF  [TSOP65P490X110_HS-13N]
U3  AD8411AWBRZ  [SOIC127P600X175-8N]

### Blocks framed on the sheet
Redundancy: Q1 Q2

### Ports
I_sense (out, see PE[6D], Isolation[3D]), P_Out (out, see PE[6D]), PIN (in, see PE[5C]), PWM (in, see PE[4D], Isolation[2B]), Ref (see PE[4D], Isolation[3C]), ~{EN} (in, see PE[4D]), ~{FAULT} (in, see PE[4D], Isolation[3B])

### Nets
+3V3: C41.1 C42.1 R3.1 U3.6(Vs)
+11V: C25.2 D1.2(A) U2.5(Vcc) U2.6(BGVcc)
AGND: C1.2 C2.1 C3.2 C4.2 C5.1 C6.2 C7.2 C8.1 C9.2 C10.2 C11.1 C12.2 C14.2 C15.1 C16.2 C17.2 C18.2 C19.1 C20.2 C21.2 C22.2 C23.1 C24.2 C25.1 C26.2 C27.2 C28.1 C29.2 C30.2 C31.1 C32.2 C34.2 C35.1 C36.2 C38.2 C39.1 C40.2 C41.2 C42.2 C43.2 C44.1 C45.2 C46.2 C47.1 C48.2 C49.2 C50.1 C51.2 D3.1(A) D4.1(A) Q2.1(S) Q3.8(S3) Q3.9(S4) Q6.2(S) R7.1 U2.7(BGRTN) U2.13(SGND) U3.2(GND) U3.3(Vref2)
P_IN: C1.1 C2.2 C3.1 C4.1 C5.2 C6.1 C7.1 C8.2 C9.1 C10.1 C11.2 C12.1 C14.1 C15.2 C16.1 C17.1 C18.1 C19.2 C20.1 C21.1 C22.1 C23.2 C24.1 C26.1 C27.1 C28.2 C29.1 C30.1 C31.2 C32.1 C34.1 C35.2 C36.1 C38.1 C39.2 C40.1 C43.1 C44.2 C45.1 C46.1 C47.2 C48.1 C49.1 C50.2 C51.1 D3.2(K) Q1.3(D) Q3.6(D3) Q3.7(D4) ; port PIN
~{FAULT}: U2.3(~{FLT}) ; port ~{FAULT}
BG: Q2.2(G) Q3.10(G2) U2.8(BG)
PWM: Q6.1(G) U2.1(PWM) ; port PWM
SW: C13.1 D4.2(K) Q1.1(S) Q2.3(D) Q3.1(S1) Q3.2(S2) Q3.3(D1) Q3.4(D2) R6.1 U2.10(SW) U3.8(+IN)
TG: Q1.2(G) Q3.5(G1) U2.11(TG)
NetC13_2: C13.2 D1.1(K) U2.12(BST)
NetDS1_1: DS1.1(A) R3.2
NetDS1_2: DS1.2(K) P1.1
NetEN_1: U2.2(~{EN}) ; port ~{EN}
NetI_Sense_1: U3.5(Out) ; port I_sense
NetMOT_1: R6.2 U3.1(-IN) ; port P_Out
NetP1_2: P1.2 Q6.3(D)
NetP5_2: U3.7(Vref1) ; port Ref
NetR7_2: R7.2 U2.4(DT)

### Notes on the sheet
- Bulk Capacitance
- 40 x 10µF 1210 X7S capacitors
- 200µF Capacitance at 30V DC bias
- @{"Id":"DPEEFADS\SWVZAZPF","ObjectType":2} @{"Id":"DPEEFADS\BADPCNSN","ObjectType":2} Alternates:
  SuperSO8: ISCH54N04NM7V
  SOT669: PSMNR90-40YSN
- (near U2) @{"Id":"DPEEFADS\LNBXRGXH","ObjectType":2} Alternates:
  LTC7060
- @{"Id":"DPEEFADS\GDXMBRQX","ObjectType":2} Alternates:
  ISG0613N04NM6HSC Exposed heat sink
  ISG0614N06NM5H 60V 1.2mOhm
- @{"Id":"DPEEFADS\BXJWEWLY","ObjectType":2} @{"Id":"DPEEFADS\IQYRYTLT","ObjectType":2} @{"Id":"DPEEFADS\KZGYWRII","ObjectType":2}
  Also contain footprints for 2x5mm electrolytic capacitors
- Jumper to REF
  V(I_sense) = I*0.05+0.6125
  I_out = (Vsense - 0.6125)/0.05
  Jumper to AGND
  V(I_sense) = I*0.05
  I_out = (Vsense )/0.05
- @{"Id":"DPEEFADS\YMRQHRAK","ObjectType":2} Alternate:
  INA241A3IDR,INA241B3IDR: Av:50
  INA241A4IDR: Av 100
  TSC2011IDT: Av 60 - Pin 4 shutdown
- (in symbol CMP-007-000000-2) 6,7; 1,2,3,4; 8,9
- (in symbol CMP-014-00003-5) Av: 50

### Library data of the parts
C1-C12 C14-C16 C18-C20 C22-C24 C27-C32 C34-C36 C38-C40 C43-C51 = CMP-001-00085-1: as C62 on sheet Power_Supply; Tolerance: 10%; Max Operating Temperature: 125°C; Case Code (Metric): 3225; Mounting Technology: Surface Mount; Case/Package: 1210; Min Operating Temperature: -55°C; Voltage Rating: 50V; Dielectric: X7S
C13 C42 = CMP-001-00083-1: as C78 on sheet Soft_Start; Case/Package: 1206; Pins: 2; Mounting Technology: Surface Mount; Min Operating Temperature: -55°C; Max Operating Temperature: 125°C; Tolerance: 10%
C17 C21 C26 = CMP-001-00084-4: Radial Can ALUMINUM ELECTROLYTIC CAPACITOR UVR 63V 4700muF ±20% 0.866Dia 22.00mm; Ripple Current: 3.2A; Pins: 2; Mounting Technology: Through Hole; Tolerance: 20%; Case/Package: Radial; Max Operating Temperature: 85°C; Voltage Rating: 63V; Min Operating Temperature: -40°C
C25 = CMP-001-00086-1: as C57 on sheet Isolation; Mounting Technology: Surface Mount; JLCPN: C1848; Max Operating Temperature: 125°C; Min Operating Temperature: -55°C; Case/Package: 1206; Tolerance: 10%; Voltage Rating: 50V
C41 = CMP-001-00090-1: as C54 on sheet Isolation; Min Operating Temperature: -55°C; Mounting Technology: Surface Mount; Tolerance: 10%; Max Operating Temperature: 125°C; Case/Package: 1206; Voltage Rating: 500V
D1 = CMP-004-00033-2: as D2 on sheet Soft_Start; Pins: 2; Min Operating Temperature: -65°C; Max Operating Temperature: 150°C; JLCPN: C14996; Case/Package: SMB; Forward Current: 2A
D3 D4 = CMP-004-00035-1: SMCJ Series 45.4 V 1.5 kW Surface Mount Uni-Directional TVS Diode - DO-214AB; Max Surge Current: 33.1A; JLCPN: C42371538; Min Operating Temperature: -65°C; Max Operating Temperature: 150°C; Mounting Technology: Surface Mount; Pins: 2
DS1 = CMP-007-00037-1: as DS4 on sheet Soft_Start; Colour: Green; Case/Package: 0805; JLCPN: C2297
P1 = CMP-002-00208-1: as P4 on sheet Soft_Start; Source: WR-PHD.SchLib; Mount: Through Hole; ComponentLink1Description: Website Link; Operating Temperature Max: 105°C; ComponentLink1URL: https://www.we-online.com/redexpert/article/61300211121?ad; Category: Board-to-Board Connectors; ComponentLink2URL: https://www.we-online.com/redexpert/spec/61300211121?ad; Number of Rows: 1; Orientation: Vertical; ComponentLink2Description: Datasheet Link; Operating Temperature Min: -40°C; Manufacturer Part Number: 61300211121; Match Code: WR-PHD; Design Item ID: 61300211121; Component Type: Standard; Pin Count: 2; Gender: Pin Header; Pitch: 2.54mm; Packaging: Bag; Pins: 2
Q1 Q2 = CMP-013-00029-7: N-channel Logic Level MOSFET, 30 V, 300 A, -55 to 175 degC, 5-Pin SOT669, RoHS, Tape and Reel; pin to pad: 1>1+2+3 2>4 3>5; Transistor Type: 1N-Channel; Vgs (Max): 20V; RoHS Compliant: True; Pins: 5
Q3 = CMP-007-000000-2: Small Signal Dual N-Channel Enhancement Transistor, Pin 1 Source, 2 Source, 3 Drain, 4 Drain, 5 Gate, 6 Drain, 7 Drain, 8 Source, 9 Source 10 Gate, 10 Pins; Manufacturer: Infineon Technologies; Design Item ID: ISG0613N04NM6H; Source: ISG0613N04NM6H.SchLib; Manufacturer Order Number: ISG0613N04NM6H; PackageReference: PG-VITFN-10-1
Q6 = CMP-013-00021-4: as Q7 on sheet Soft_Start; Packaging: TapeandReel; Package Description: 3-Pin Small Outline Transistor, Body 2.92 x 1.325 mm, Pitch 0.95 mm; Datasheet URL: https://www.fairchildsemi.com/datasheets/BS/BSS138.pdf; Min Operating Temperature: -55°C; Pins: 3; RoHS Compliant: True; Package Reference: SOT23-3; Package Quantity: 1; Case/Package: TO-236-3; Mounting Technology: SM; Max Operating Temperature: 150°C; Datasheet Version: Rev. C, 10/2005
R3 = CMP-009-00191-2: Thick Film Resistors - SMD RMC 0805 1/8W 1% T/R-5000; Power: 125mW; JLCPN: C17714
R6 = CMP-009-00182-2: Fixed Resistor, Metal Strip, 5W, 1ohm, 0.0707V, 1% +/-Tol, 100ppm/Cel, Surface Mount, 2512; Tolerance: 1%; Max Operating Temperature: 170°C; Min Operating Temperature: -55°C; Mounting Technology: Surface Mount
R7 = CMP-009-00184-2: as R8 on sheet Isolation; JLCPN: C17902; Case/Package: 1206
U2 = CMP-00024-00008-3: Driver 6A 2-OUT High Side/Low Side Half Brdg Inv/Non-Inv 12-Pin MSOP EP Tube
U3 = CMP-014-00003-5: SP Amp Current Sense Amp Single 5.5V 8-Pin SOIC N Tube Automotive AEC-Q100; MPN: AD8411AWBRZ; JLCPN: C20047590

## Sheet Mechanical.SchDoc: Mechanical For Geec Power Electronics
size A4; CheckedBy: Conor Farrell; SheetNumber: 6; SheetTotal: 6
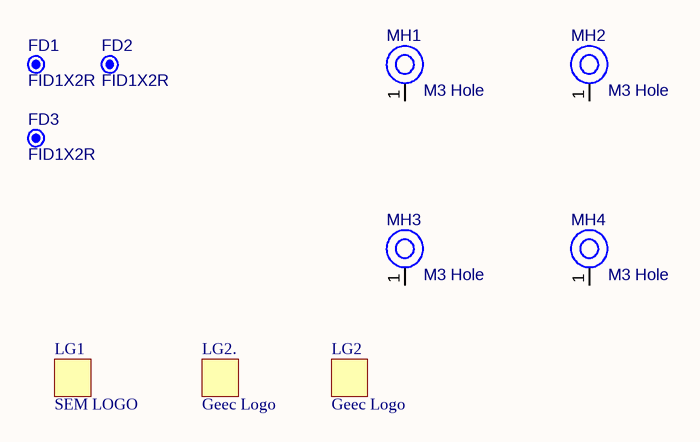
[diagram p5: Mechanical.SchDoc]

### Parts
FD1  FID1X2R  [FID1X2R]  (no BOM)
FD2  FID1X2R  [FID1X2R]  (no BOM)
FD3  FID1X2R  [FID1X2R]  (no BOM)
LG1  SEM LOGO  [SEM LOGO-Footprint-1]  (no BOM)
LG2  Geec Logo  [Geec Logo-Footprint-1]  (no BOM)
LG2.  Geec Logo  [Geec Logo-Footprint-1]  (no BOM)
MH1  M3 Hole  [M3 Hole-Footprint-1]  (no BOM)
MH2  M3 Hole  [M3 Hole-Footprint-1]  (no BOM)
MH3  M3 Hole  [M3 Hole-Footprint-1]  (no BOM)
MH4  M3 Hole  [M3 Hole-Footprint-1]  (no BOM)

### Nets

Not connected (* = marked no-connect by the designer): MH1 1(H1); MH2 1(H1); MH3 1(H1); MH4 1(H1)

### Library data of the parts
FD1-FD3 = CMP-00028-00005-2: Fiducial - Round 1x2mm; Pins: 0
LG1 = CMP-00028-00008-2: SEM Logo Required for Power Electronics
LG2 LG2. = CMP-00028-00009-2
MH1-MH4 = CMP-00028-00007-2: Hole for M3 bolt

## Nets that join several sheets
+3V3: PE (R1.2 R2.2 U1.12), Soft_Start (R20.1), Isolation (10 pins), Power_Supply (8 pins), Power_Stage (C41.1 C42.1 R3.1 U3.6)
+5V ISO: PE (J1.2), Isolation (10 pins)
+11V: PE (J1.12), Soft_Start (D2.2 U9.1), Power_Supply (14 pins), Power_Stage (C25.2 D1.2 U2.5 U2.6)
AGND: PE (9 pins), Soft_Start (Q7.2 U9.2 U9.3 U9.5), Isolation (11 pins), Power_Supply (23 pins), Power_Stage (59 pins)
GND ISO: PE (J1.1), Isolation (10 pins)
P_IN: PE (P_IN1.1 P_IN2.1), Soft_Start (6 pins), Power_Stage (49 pins)
VBat: PE (U1.8 VBAT.1), Soft_Start (Q4.3 Q5.3 R21.2), Power_Supply (5 pins)
~{FAULT}: PE (FAULT.1 U1.11), Isolation (R12.1 U5.11), Power_Stage (U2.3)
~{FAULT ISO}: PE (J1.7), Isolation (U5.6)
EN_ISO: PE (J1.5), Isolation (U5.4)
I_sense ISO: PE (J1.3), Isolation (R13.1 U6.6)
NetEN_1: PE (EN.1), Isolation (U5.13), Power_Stage (U2.2)
NetI_Sense_1: PE (I_Sense.1), Isolation (U6.12), Power_Stage (U3.5)
NetMOT_1: PE (MOT.1 MP3.1), Power_Stage (R6.2 U3.1)
NetP5_2: Isolation (P5.2), Power_Stage (U3.7)
PWM: PE (PWM.1), Isolation (U5.14), Power_Stage (Q6.1 U2.1)
PWM_ISO: PE (J1.4), Isolation (U5.3)
SCL: PE (SCL.1 U1.6), Isolation (R10.1 U4.6)
SCL_ISO: PE (J1.9), Isolation (R11.1 U4.3)
SDA: PE (SDA.1 U1.5), Isolation (R8.1 U4.7)
SDA_ISO: PE (J1.8), Isolation (R9.1 U4.2)
Soft START: PE (SOFT.1), Soft_Start (Q7.1 U9.4), Isolation (U5.12)
SOFT START ISO: PE (J1.6), Isolation (U5.5)

## Assembly variants
Variant of GeecPE: all parts fitted
Assembly Variant: not fitted +3V3 +11V AGND1 AGND2 AGND3 C17 C21 C26 EN FAULT I_Sense J1 MH1 MH2 MH3 MH4 MOT MP1 MP2 MP4 MP? P1 P2 P3 P4 P IN1 P IN2 P? PWM Q1 Q2 R21 R? R? SCL SDA SOFT VBAT